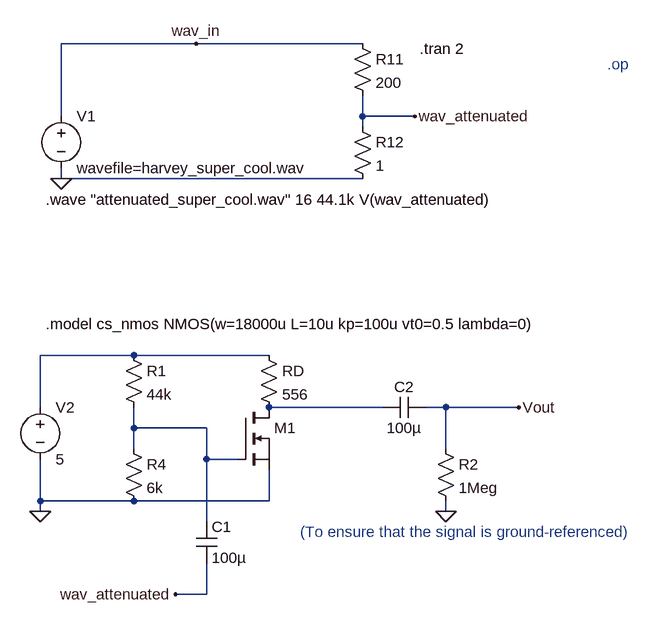
[diagram p0: schematic part_1_g.asc]
part_1_g.asc, the LTspice schematic file:
Version 4
SHEET 1 1372 1032
WIRE 400 -48 192 -48
WIRE 656 -48 400 -48
WIRE 192 64 192 -48
WIRE 656 64 656 32
WIRE 736 64 656 64
WIRE 656 80 656 64
WIRE 192 160 192 144
WIRE 656 160 192 160
WIRE 304 432 160 432
WIRE 512 432 304 432
WIRE 160 512 160 432
WIRE 688 512 512 512
WIRE 784 512 752 512
WIRE 896 512 784 512
WIRE 304 544 304 512
WIRE 416 544 304 544
WIRE 304 576 304 544
WIRE 784 576 784 512
WIRE 416 592 416 544
WIRE 464 592 416 592
WIRE 160 656 160 592
WIRE 304 656 160 656
WIRE 512 656 512 608
WIRE 512 656 304 656
WIRE 160 672 160 656
WIRE 784 672 784 656
WIRE 416 688 416 592
WIRE 416 800 416 752
WIRE 416 800 368 800
FLAG 400 -48 wav_in
FLAG 736 64 wav_attenuated
FLAG 192 160 0
FLAG 160 672 0
FLAG 896 512 Vout
FLAG 784 672 0
FLAG 368 800 wav_attenuated
SYMBOL voltage 192 48 R0
SYMATTR InstName V1
SYMATTR Value wavefile=harvey_super_cool.wav
SYMBOL res 640 -64 R0
SYMATTR InstName R11
SYMATTR Value 200
SYMBOL res 640 64 R0
SYMATTR InstName R12
SYMATTR Value 1
SYMBOL nmos 464 512 R0
SYMATTR InstName M1
SYMATTR Value ""
SYMATTR SpiceModel cs_nmos
SYMBOL voltage 160 496 R0
WINDOW 123 0 0 Left 0
WINDOW 39 0 0 Left 0
SYMATTR InstName V2
SYMATTR Value 5
SYMBOL res 288 416 R0
SYMATTR InstName R1
SYMATTR Value 44k
SYMBOL res 288 560 R0
SYMATTR InstName R4
SYMATTR Value 6k
SYMBOL res 496 416 R0
SYMATTR InstName RD
SYMATTR Value 556
SYMBOL cap 400 688 R0
SYMATTR InstName C1
SYMATTR Value 100µ
SYMBOL cap 752 496 R90
WINDOW 0 0 32 VBottom 2
WINDOW 3 32 32 VTop 2
SYMATTR InstName C2
SYMATTR Value 100µ
SYMBOL res 768 560 R0
SYMATTR InstName R2
SYMATTR Value 1Meg
TEXT 168 192 Left 2 !.wave "attenuated_super_cool.wav" 16 44.1k V(wav_attenuated)
TEXT 744 -40 Left 2 !.tran 2
TEXT 1032 -16 Left 2 ;.op
TEXT 168 384 Left 2 !.model cs_nmos NMOS(w=18000u L=10u kp=100u vt0=0.5 lambda=0)
TEXT 560 704 Left 2 ;(To ensure that the signal is ground-referenced)

The netlist it stands for:
* part_1_g.asc
V1 wav_in 0 wavefile=harvey_super_cool.wav
R11 wav_in wav_attenuated 200
R12 wav_attenuated 0 1
M1 N002 N003 0 0 cs_nmos
V2 N001 0 5
R1 N001 N003 44k
R4 N003 0 6k
RD N001 N002 556
C1 N003 wav_attenuated 100µ
C2 Vout N002 100µ
R2 Vout 0 1Meg
.model NMOS NMOS
.model PMOS PMOS
.lib standard.mos
.wave "attenuated_super_cool.wav" 16 44.1k V(wav_attenuated)
.tran 2
* .op
.model cs_nmos NMOS(w=18000u L=10u kp=100u vt0=0.5 lambda=0)
* (To ensure that the signal is ground-referenced)
.backanno
.end